# EAGLE schematic CAP (EAGLE 7.1.0)
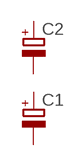
[diagram p0: schematic, sheet 1]

## Parts
C1  CPOL-EUE10-35CAP-D51-P22  [EB51D]
C2  CPOL-EUE10-35CAP-D51-P22  [EB51D]
Unconnected: C1.+ C1.- C2.+ C2.-

## Library data of the parts
C1 C2 = resistor:CPOL-EU: POLARIZED CAPACITOR, European symbol